# Altium schematic sheet schematic.SchDoc
size A2
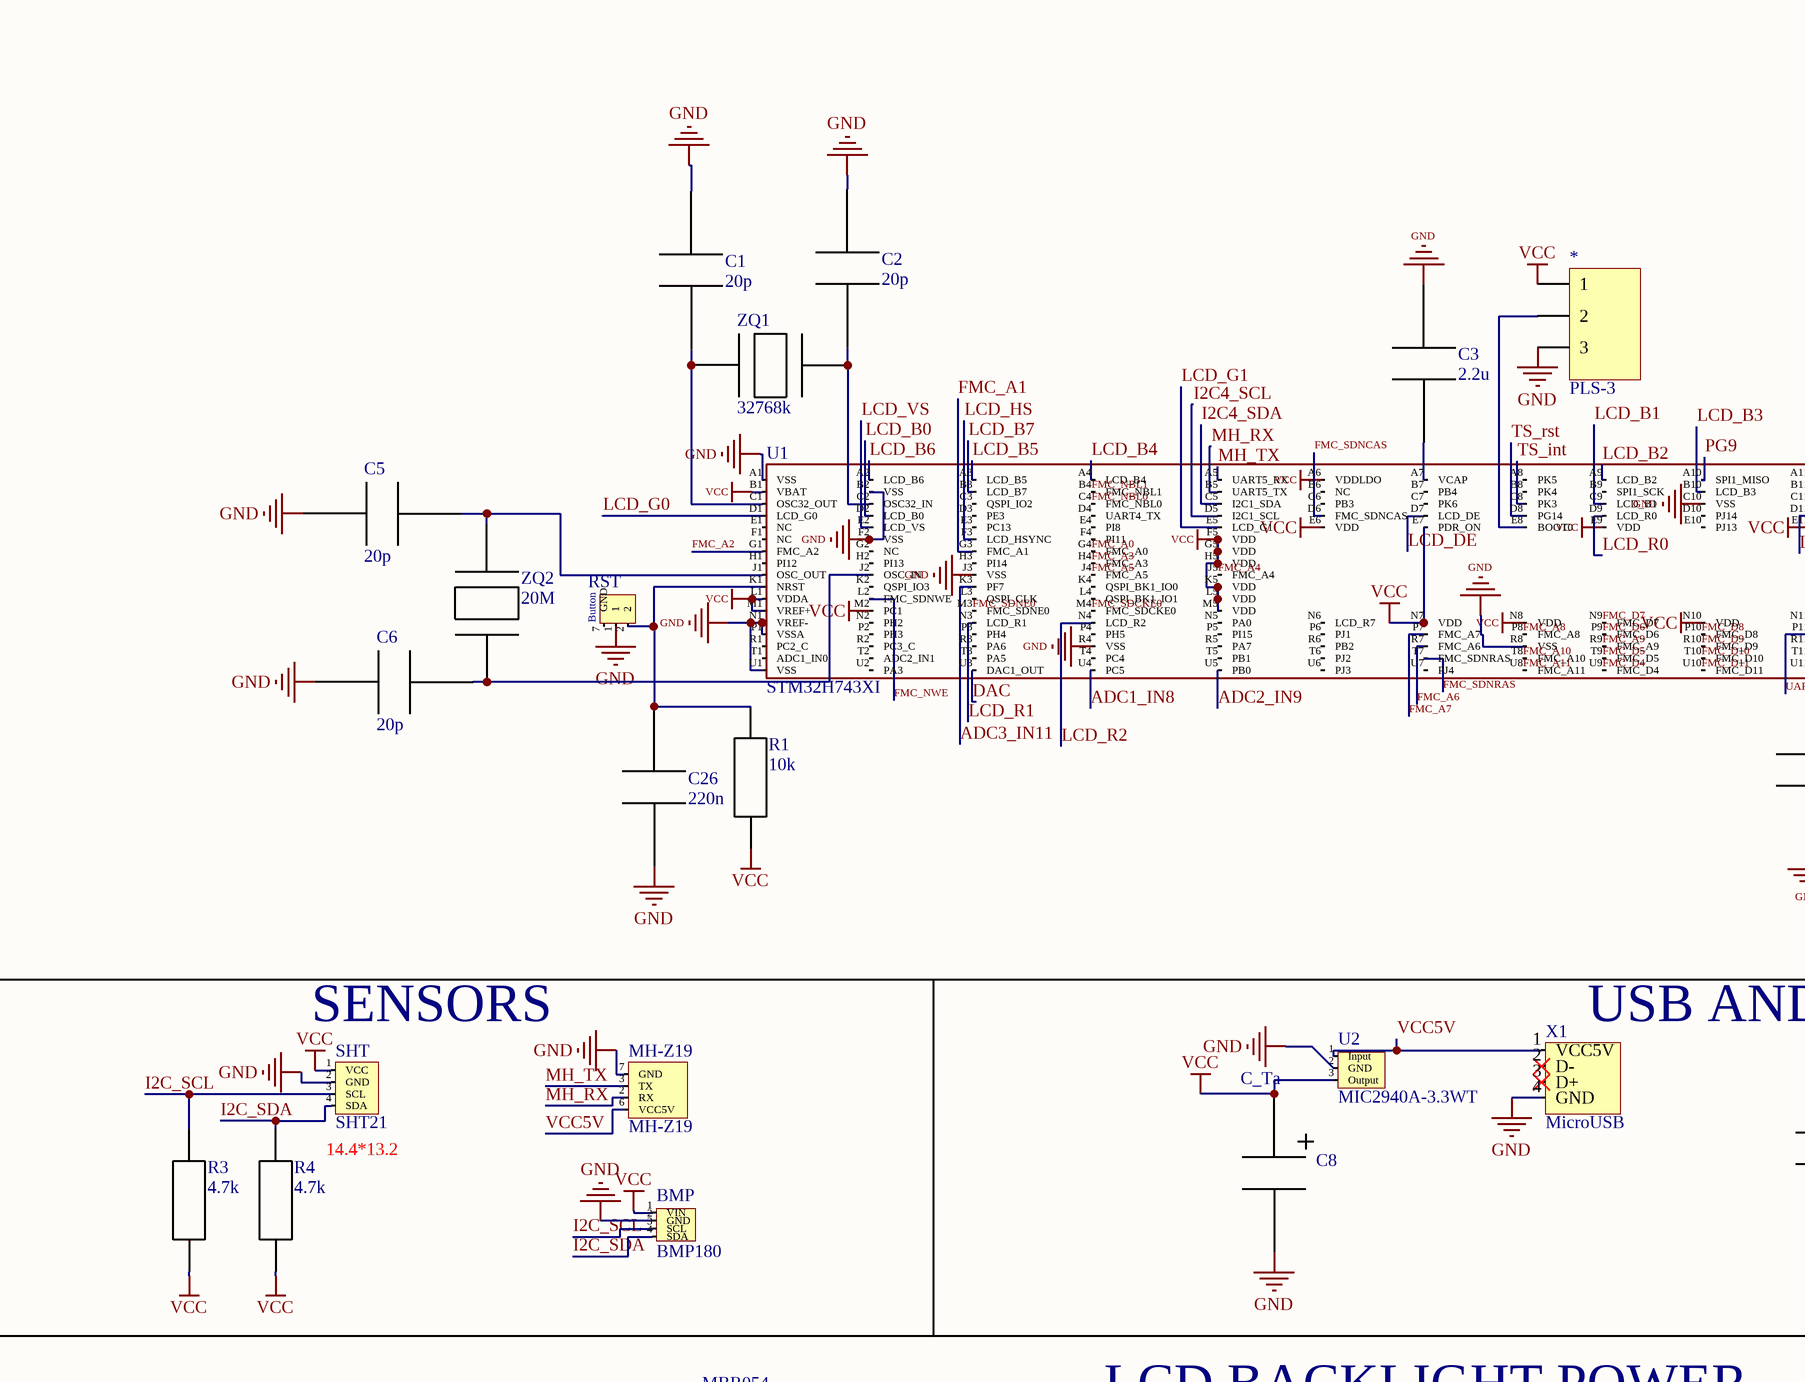
[diagram p0: schematic.SchDoc, top left]
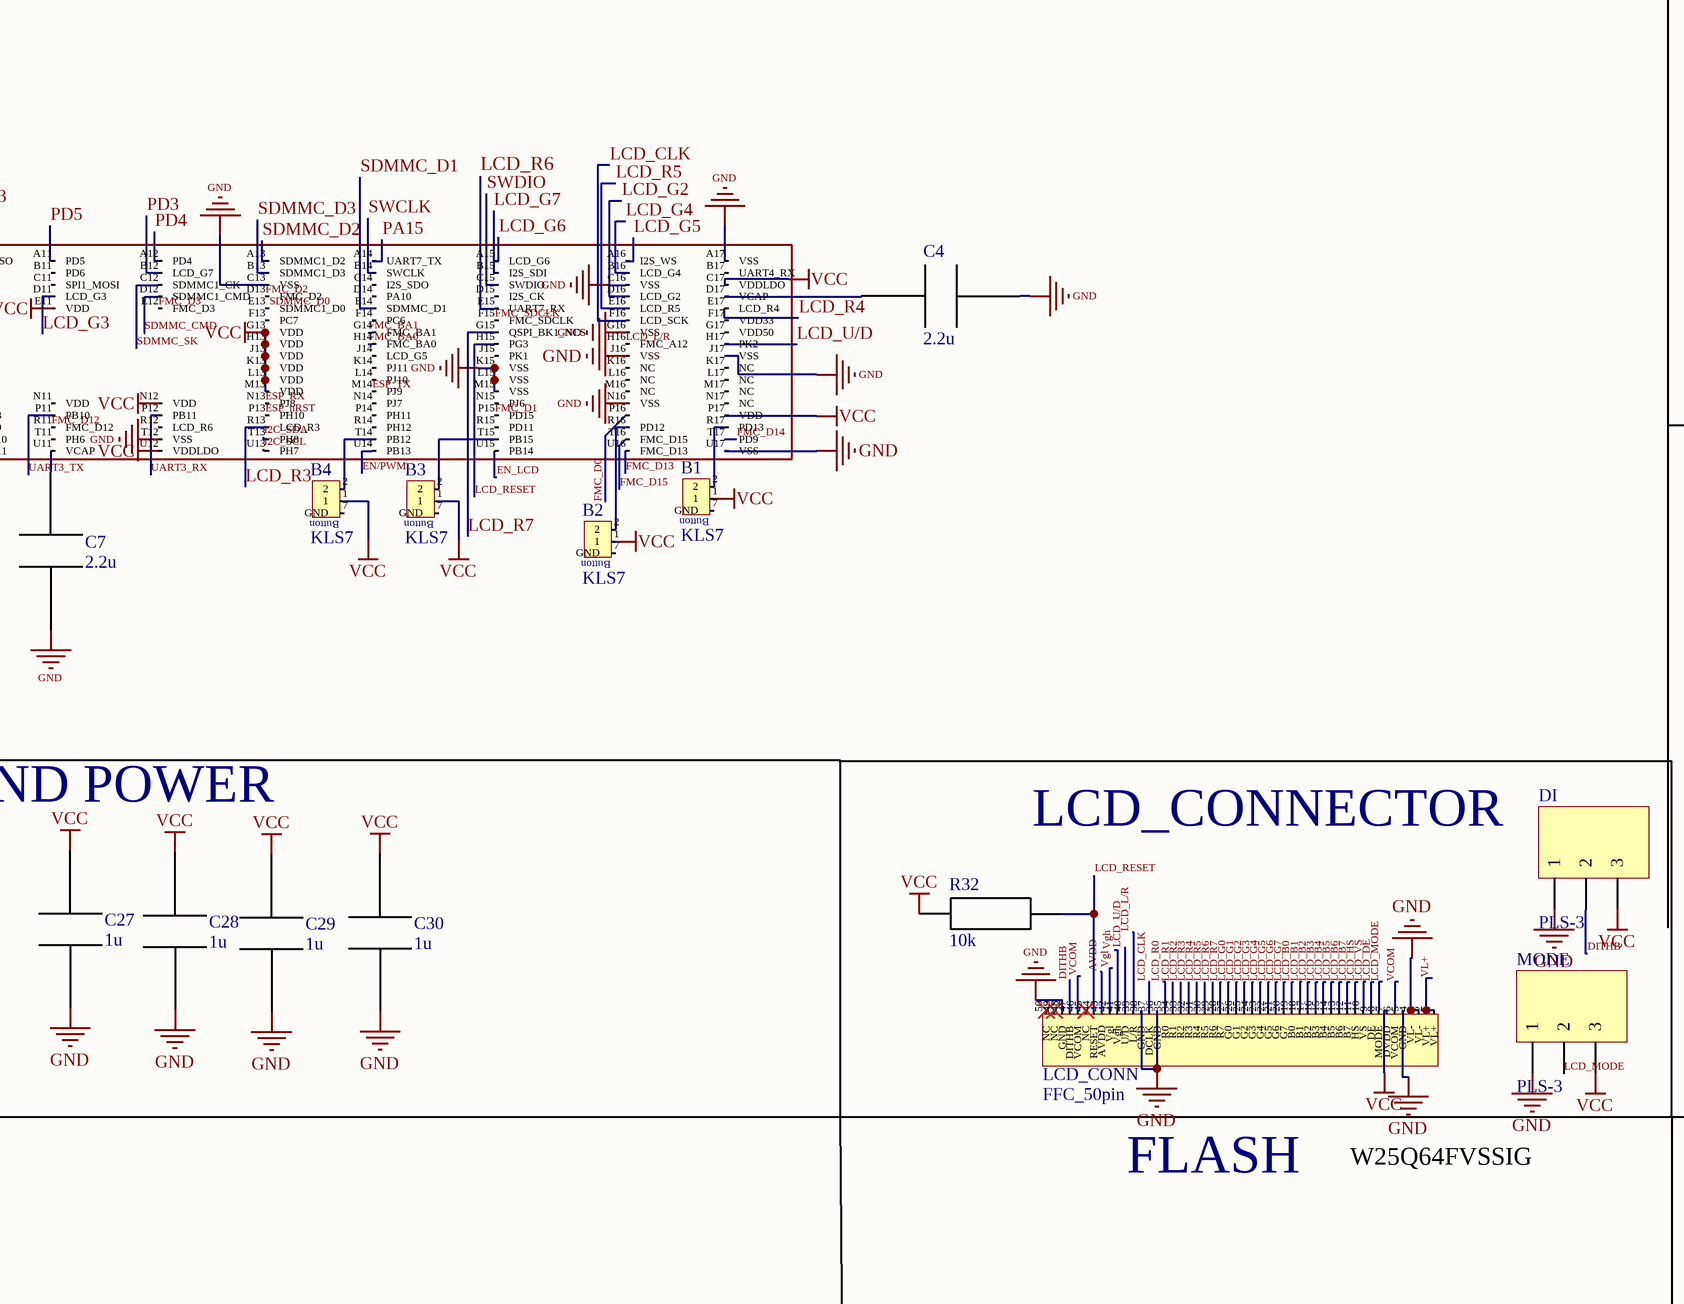
[diagram p1: schematic.SchDoc, top middle]
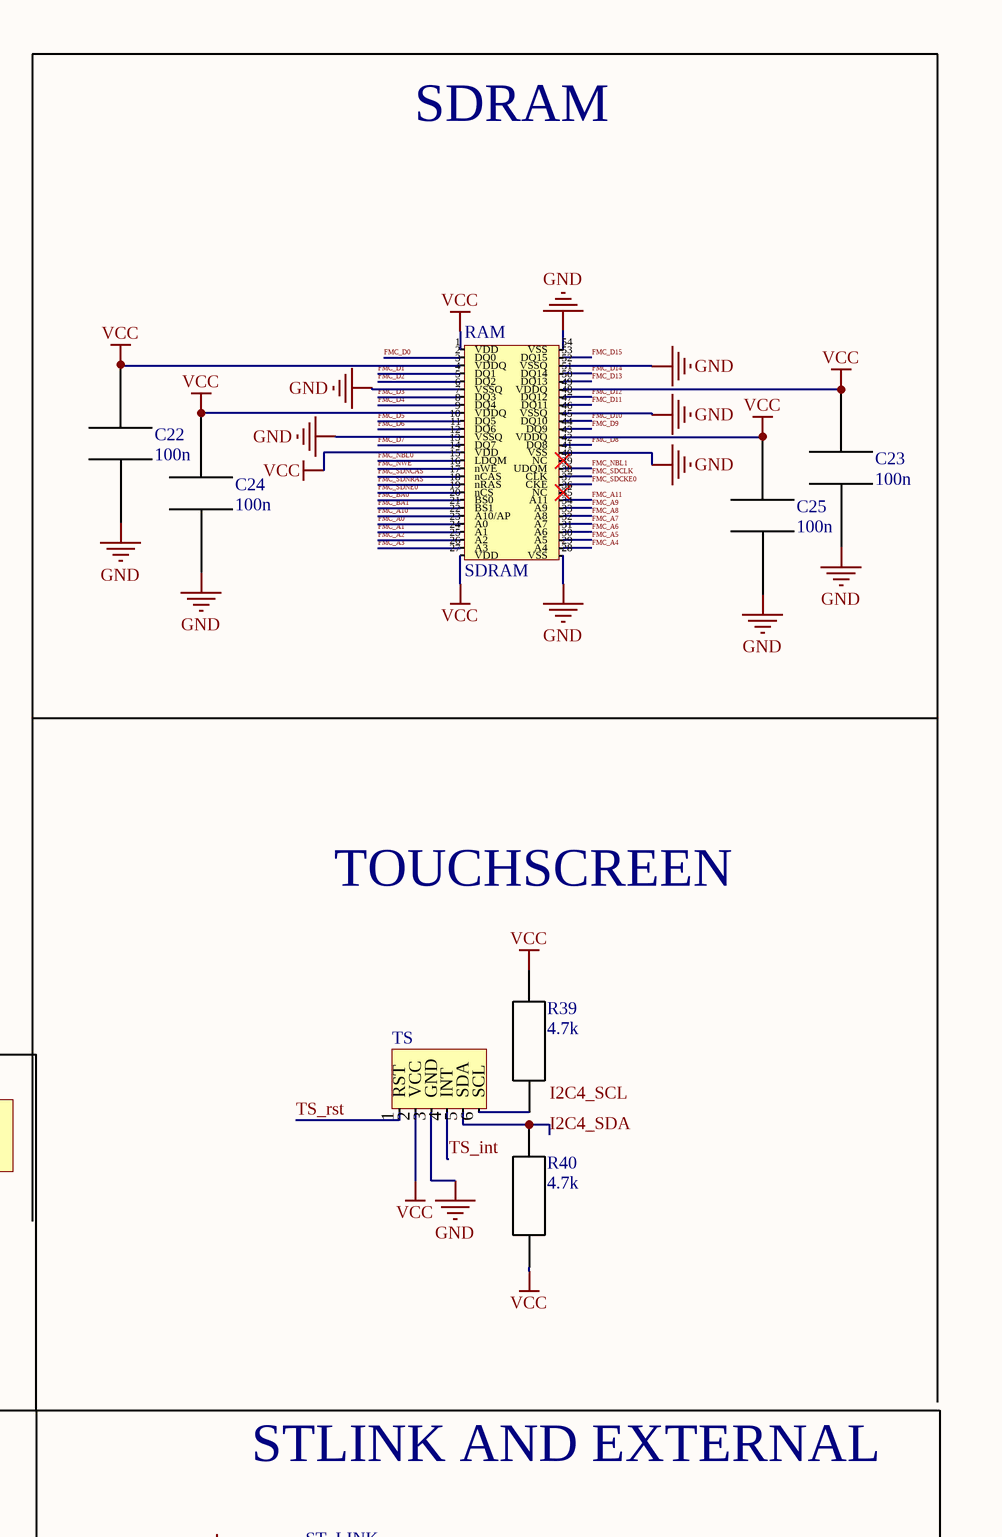
[diagram p2: schematic.SchDoc, top right]
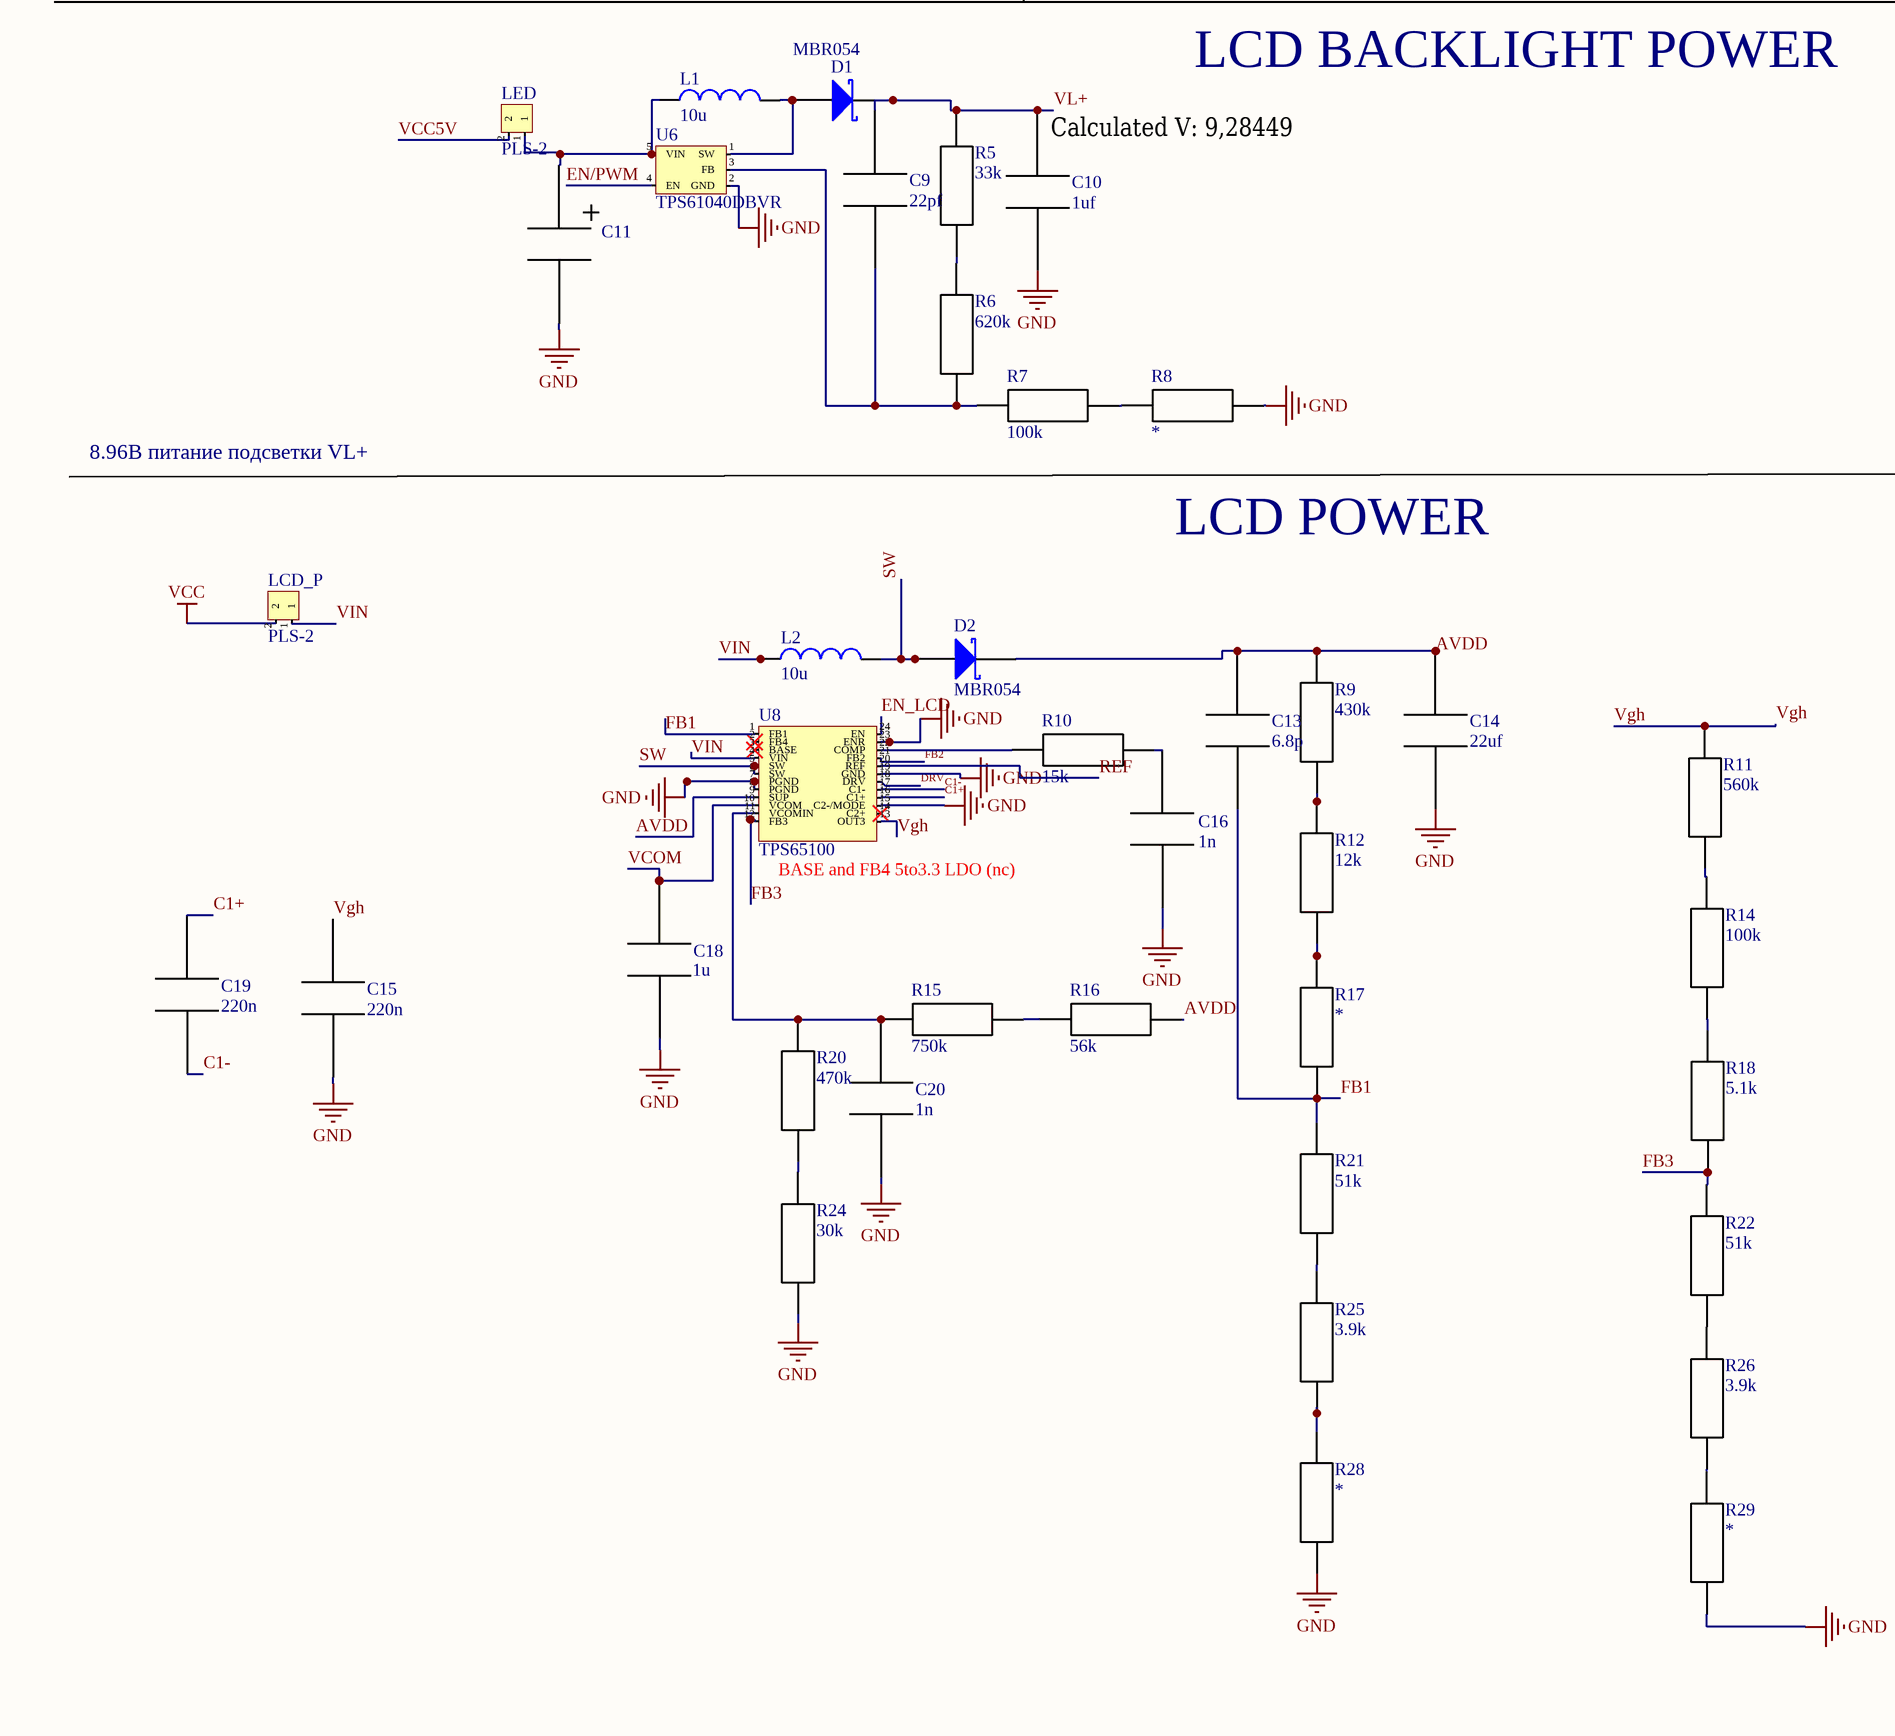
[diagram p3: schematic.SchDoc, bottom left]
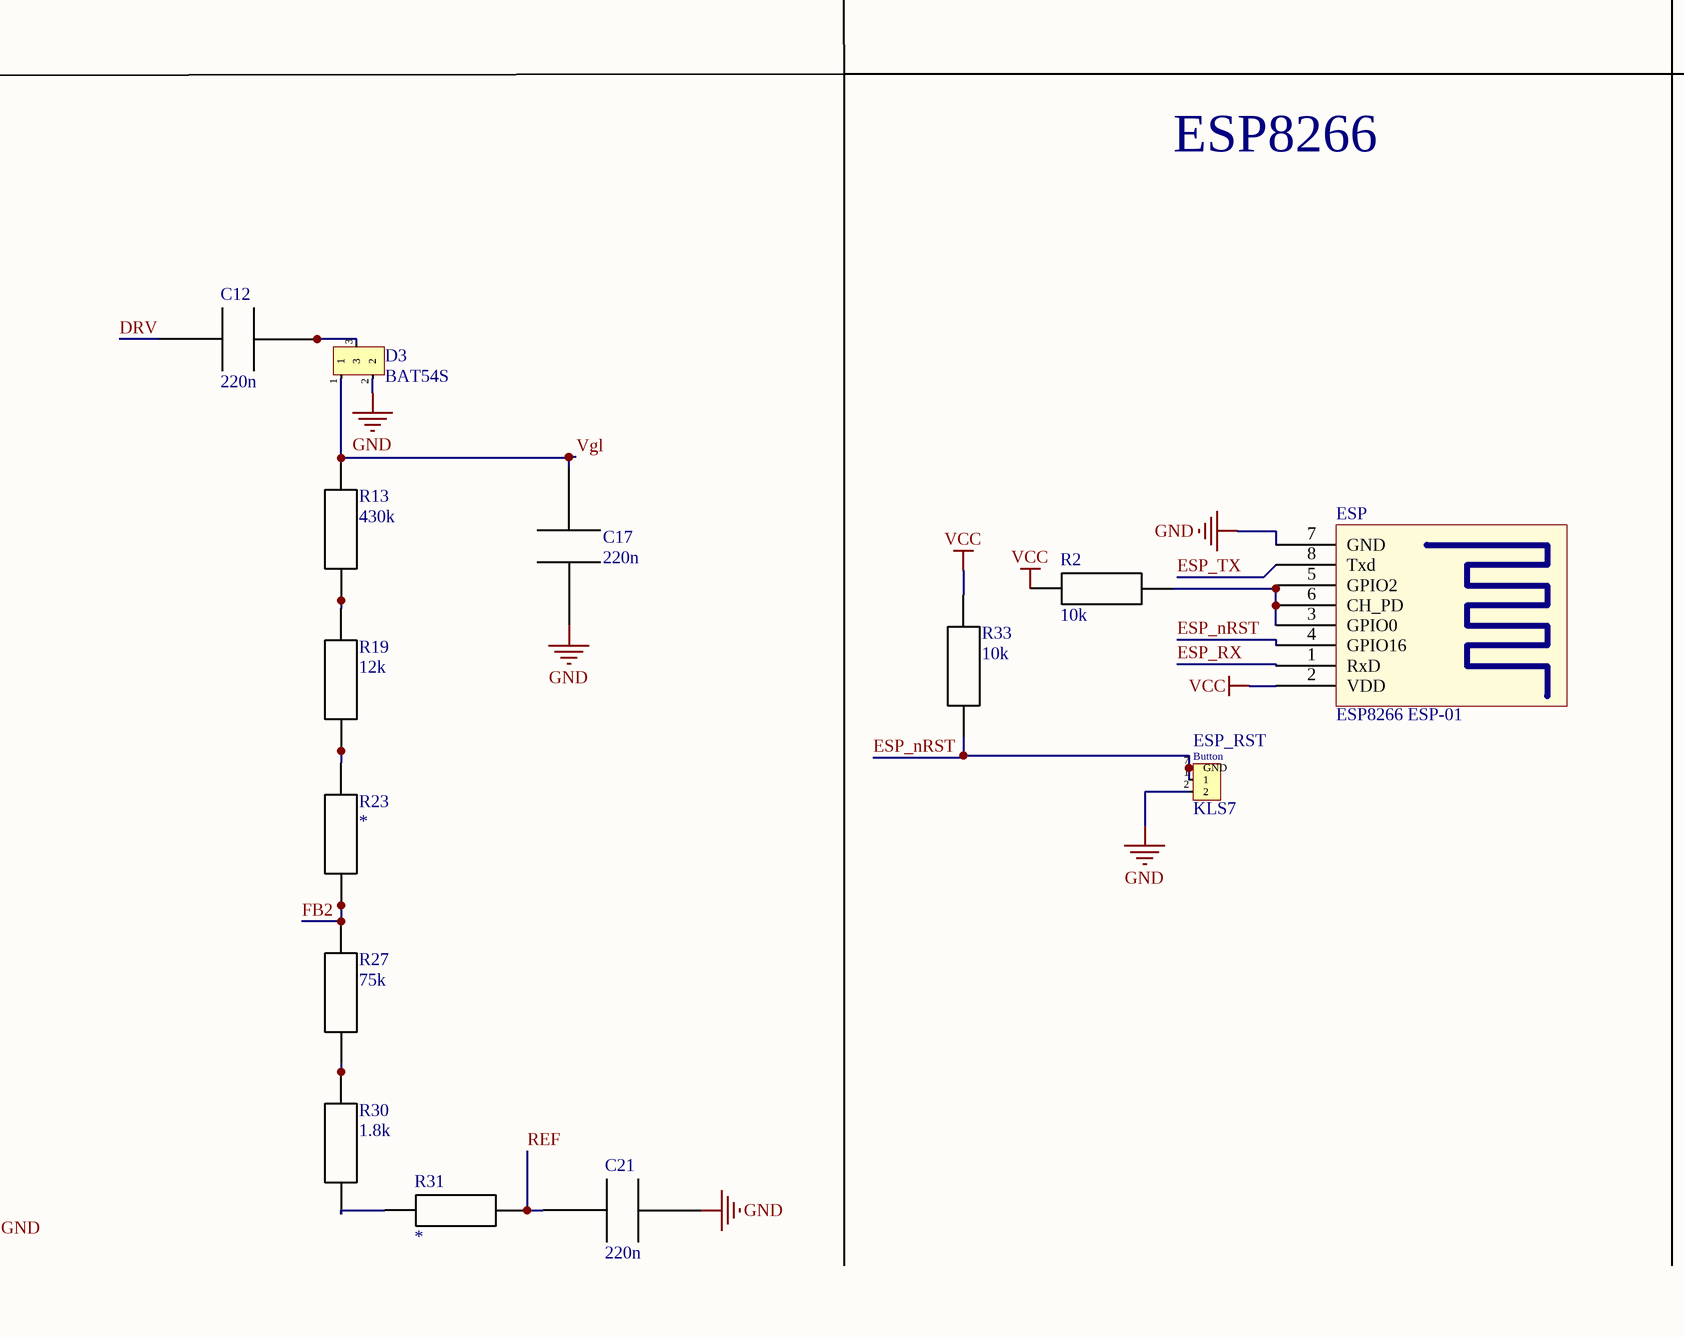
[diagram p4: schematic.SchDoc, bottom middle]
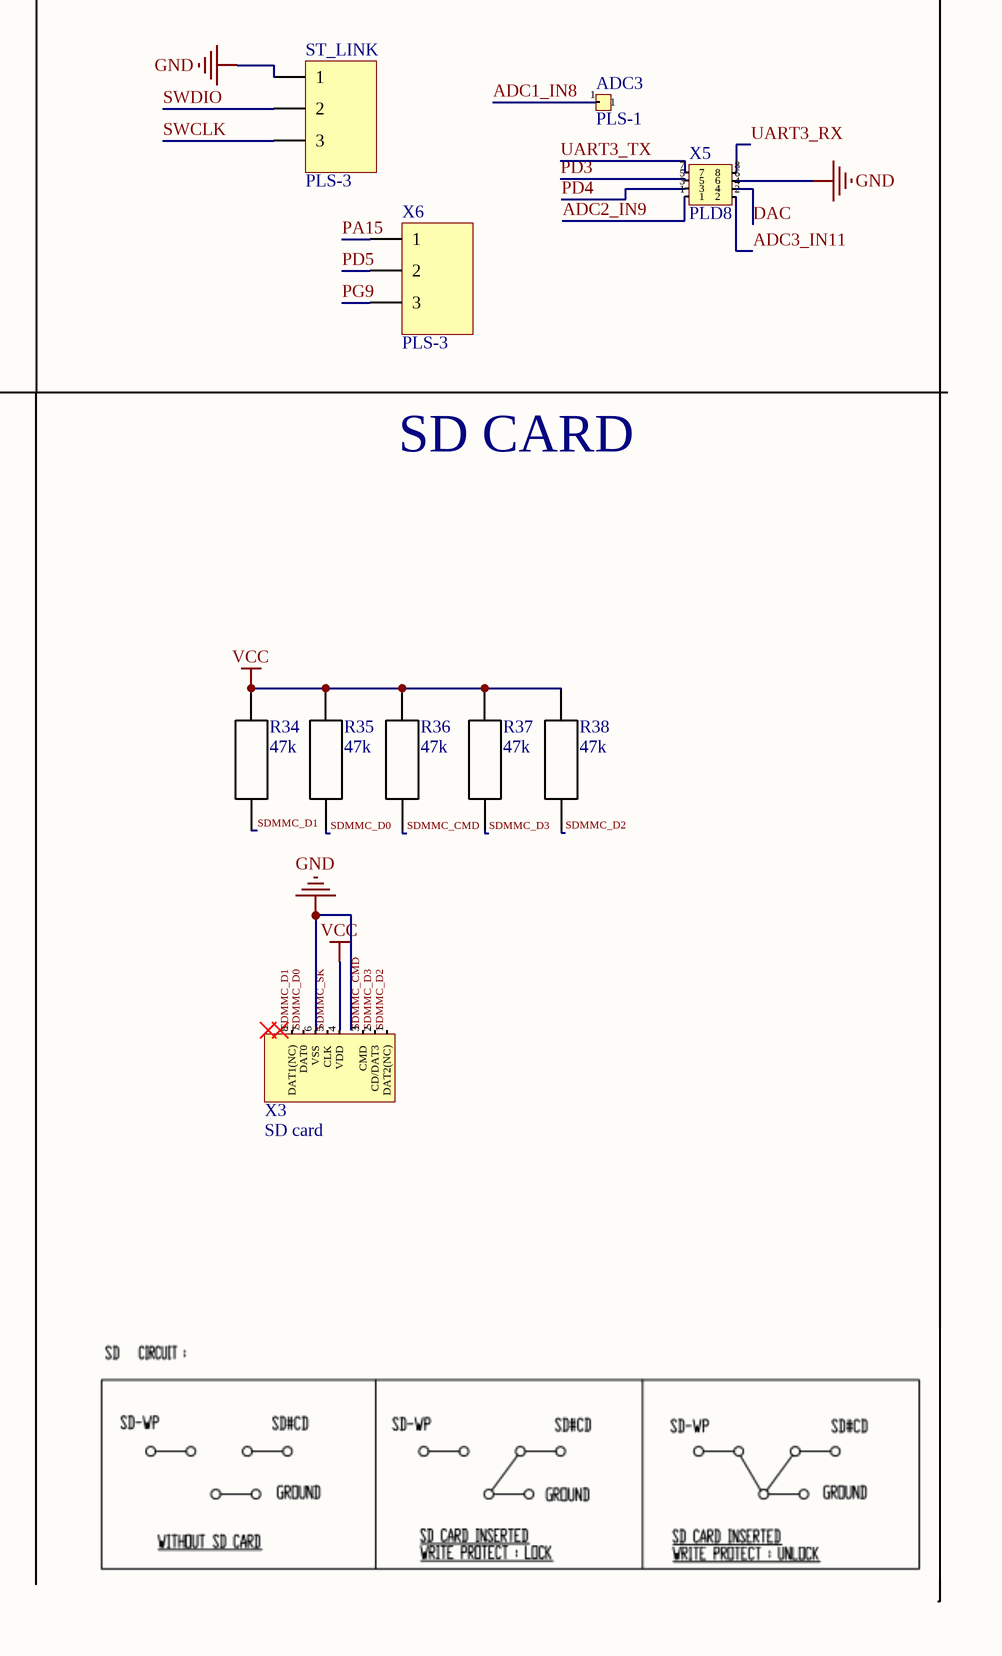
[diagram p5: schematic.SchDoc, bottom right]

## Parts
*  PLS-3  [PLS-3]
ADC3  PLS-1  [pls-1]
B1  KLS7  [angle_button]
B2  KLS7  [angle_button]
B3  KLS7  [angle_button]
B4  KLS7  [angle_button]
BMP  BMP180  [PLS-4]
C1  20p  [0805]
C2  20p  [0805]
C3  2.2u  [0805]
C4  2.2u  [0805]
C5  20p  [0805]
C6  20p  [0805]
C7  2.2u  [0805]
C8  C_Ta  [C_Ta]
C9  22pf  [0805]
C10  1uf  [0805]
C11  C_Ta  [C_Ta]  (value not drawn)
C12  220n  [0805]
C13  6.8p  [0805]
C14  22uf  [0805]
C15  220n  [0805]
C16  1n  [0805]
C17  220n  [0805]
C18  1u  [0805]
C19  220n  [0805]
C20  1n  [0805]
C21  220n  [0805]
C22  100n  [0805]
C23  100n  [0805]
C24  100n  [0805]
C25  100n  [0805]
C26  220n  [0805]
C27  1u  [0603]
C28  1u  [0603]
C29  1u  [0603]
C30  1u  [0603]
D1  MBR054  [sod123]
D2  MBR054  [sod123]
D3  BAT54S  [sot23]
DI  PLS-3  [PLS-3]
ESP  ESP8266 ESP-01  [ESP8266 ESP-01]
ESP_RST  KLS7  [KLS7]
L1  10u  [0604]
L2  10u  [0604]
LCD_CONN  FFC_50pin  [FFC_50pin]
LCD_P  PLS-2  [PLS-2]
LED  PLS-2  [PLS-2]
MH-Z19  MH-Z19  [MH-Z19]
MODE  PLS-3  [PLS-3]
R1  10k  [0805]
R2  10k  [0805]
R3  4.7k  [0805]
R4  4.7k  [0805]
R5  33k  [0805]
R6  620k  [0805]
R7  100k  [0805]
R8  *  [0805]
R9  430k  [0805]
R10  15k  [0805]
R11  560k  [0805]
R12  12k  [0805]
R13  430k  [0805]
R14  100k  [0805]
R15  750k  [0805]
R16  56k  [0805]
R17  *  [0805]
R18  5.1k  [0805]
R19  12k  [0805]
R20  470k  [0805]
R21  51k  [0805]
R22  51k  [0805]
R23  *  [0805]
R24  30k  [0805]
R25  3.9k  [0805]
R26  3.9k  [0805]
R27  75k  [0805]
R28  *  [0805]
R29  *  [0805]
R30  1.8k  [0805]
R31  *  [0805]
R32  10k  [0805]
R33  10k  [0805]
R34  47k  [0805]
R35  47k  [0805]
R36  47k  [0805]
R37  47k  [0805]
R38  47k  [0805]
R39  4.7k  [0805]
R40  4.7k  [0805]
RAM  SDRAM  [SDRAM TSOP2]
RST  KLS7  [KLS7]  (value not drawn)
SHT  SHT21  [PLS-4]
ST_LINK  PLS-3  [PLS-3]
TS  FFC_6pin  (value not drawn)
U1  STM32H743XI  [STM32H742xI]
U2  MIC2940A-3.3WT  [PLS-3]
U6  TPS61040DBVR  [sot-23-5]
U8  TPS65100  [TPS6510]
X1  MicroUSB  [MICRO_USB]
X3  SD card  [microSDconn]
X5  PLD8  [PLD-8]
X6  PLS-3  [PLS-3]
ZQ1  32768k  [XTAL]
ZQ2  20M  [XTAL]

## Nets
LCD_G2: *.3 BMP.2(GND) C1.1 C2.1 C3.2 C4.2 C5.1 C6.1 C7.2 C8.2 C10.1 C11.2 C14.1 C15.2 C16.2 C17.2 C18.2 C20.2 C21.2 C22.2 C23.2 C24.2 C25.2 C26.2 C27.1 C28.1 C29.1 C30.1 D3.2 DI.1 ESP.7(GND) ESP_RST.2 LCD_CONN.3(VL-) LCD_CONN.4(VL-) LCD_CONN.5(GND) LCD_CONN.25(G2) LCD_CONN.36(GND) LCD_CONN.38(GND) LCD_CONN.48(GND) MH-Z19.7(GND) MODE.1 R8.1 R24.2 R28.1 R29.1 RAM.6(VSSQ) RAM.12(VSSQ) RAM.28(VSS) RAM.41(VSS) RAM.46(VSSQ) RAM.52(VSSQ) RAM.54(VSS) RST.1 SHT.2(GND) ST_LINK.1 TS.3(GND) U1.A1(VSS) U1.A17(VSS) U1.B2(VSS) U1.C10(VSS) U1.C13(VSS) U1.C16(VSS) U1.D16(LCD_G2) U1.F2(VSS) U1.G16(VSS) U1.J3(VSS) U1.J16(VSS) U1.J17(VSS) U1.K15(VSS) U1.L15(VSS) U1.M15(VSS) U1.N1(VREF-) U1.N16(VSS) U1.P1(VSSA) U1.R4(VSS) U1.R8(VSS) U1.T12(VSS) U1.U1(VSS) U1.U17(VSS) U2.2(GND) U6.2(GND) U8.7(PGND) U8.8(PGND) U8.15(C2-/MODE) U8.19(GND) U8.23(ENR) X1.4(GND) X3.6(VSS) X5.6  [also labelled GND]
VCC: *.1 B1.1 B2.1 B3.1 B4.1 BMP.1(VIN) C8.1 C22.1 C23.1 C24.1 C25.1 C27.2 C28.2 C29.2 C30.2 DI.3 ESP.2(VDD) LCD_CONN.7(DVDD) LCD_P.2 MODE.3 R1.1 R2.1 R3.2 R4.2 R32.1 R33.2 R34.2 R35.2 R36.2 R37.2 R38.2 R39.2 R40.1 RAM.1(VDD) RAM.3(VDDQ) RAM.9(VDDQ) RAM.14(VDD) RAM.27(VDD) RAM.43(VDDQ) RAM.49(VDDQ) SHT.1(VCC) TS.2(VCC) U1.A6(VDDLDO) U1.B1(VBAT) U1.C17(VDDLDO) U1.E6(VDD) U1.E7(PDR_ON) U1.E9(VDD) U1.E11(VDD) U1.F5(VDD) U1.G5(VDD) U1.G13(VDD) U1.H5(VDD) U1.H13(VDD) U1.J13(VDD) U1.K5(VDD) U1.K13(VDD) U1.L1(VDDA) U1.L5(VDD) U1.L13(VDD) U1.M1(VREF+) U1.M2(PC1) U1.M5(VDD) U1.M13(VDD) U1.N7(VDD) U1.N8(VDD) U1.N10(VDD) U1.N12(VDD) U1.P17(VDD) U1.U12(VDDLDO) U2.3(Output) X3.4(VDD)
ADC1_IN8: ADC3.1 U1.U4(PC5)
ADC2_IN9: U1.U5(PB0) X5.1
ADC3_IN11: U1.K3(PF7) X5.2
AVDD: C13.2 C14.2 D2.2(K) LCD_CONN.43(AVDD) R9.1 R16.2 U8.9(SUP)
C1+: C19.1 U8.16(C1+)
C1-: C19.2 U8.17(C1-)
DAC: U1.U3(DAC1_OUT) X5.4
DITHB: DI.2 LCD_CONN.47(DITHB)
DRV: C12.1 U8.18(DRV)
EN/PWM: U1.U14(PB13) U6.4(EN)
EN_LCD: U1.U15(PB14) U8.24(EN)
ESP_nRST: ESP.4(GPIO16) ESP_RST.1 ESP_RST.7(GND) R33.1 U1.P13(PH10)
ESP_RX: ESP.1(RxD) U1.N13(PJ8)
ESP_TX: ESP.8(Txd) U1.M14(PJ9)
FB1: C13.1 R17.1 R21.2 U8.1(FB1)
FB2: R23.1 R27.1 U8.21(FB2)
FB3: R18.1 R22.1 U8.12(FB3)
FMC_A0: RAM.23(A0) U1.G4(FMC_A0)
FMC_A1: RAM.24(A1) U1.G3(FMC_A1)
FMC_A2: RAM.25(A2) U1.G1(FMC_A2)
FMC_A3: RAM.26(A3) U1.H4(FMC_A3)
FMC_A4: RAM.29(A4) U1.J5(FMC_A4)
FMC_A5: RAM.30(A5) U1.J4(FMC_A5)
FMC_A6: RAM.31(A6) U1.R7(FMC_A6)
FMC_A7: RAM.32(A7) U1.P7(FMC_A7)
FMC_A8: RAM.33(A8) U1.P8(FMC_A8)
FMC_A9: RAM.34(A9) U1.R9(FMC_A9)
FMC_A10: RAM.22(A10/AP) U1.T8(FMC_A10)
FMC_A11: RAM.35(A11) U1.U8(FMC_A11)
FMC_BA0: RAM.20(BS0) U1.H14(FMC_BA0)
FMC_BA1: RAM.21(BS1) U1.G14(FMC_BA1)
FMC_D0: RAM.2(DQ0) U1.P16
FMC_D1: RAM.4(DQ1) U1.P15(PD15)
FMC_D2: RAM.5(DQ2) U1.D13(FMC_D2)
FMC_D3: RAM.7(DQ3) U1.E12(FMC_D3)
FMC_D4: RAM.8(DQ4) U1.U9(FMC_D4)
FMC_D5: RAM.10(DQ5) U1.T9(FMC_D5)
FMC_D6: RAM.11(DQ6) U1.P9(FMC_D6)
FMC_D7: RAM.13(DQ7) U1.N9(FMC_D7)
FMC_D8: RAM.42(DQ8) U1.P10(FMC_D8)
FMC_D9: RAM.44(DQ9) U1.R10(FMC_D9)
FMC_D10: RAM.45(DQ10) U1.T10(FMC_D10)
FMC_D11: RAM.47(DQ11) U1.U10(FMC_D11)
FMC_D12: RAM.48(DQ12) U1.R11(FMC_D12)
FMC_D13: RAM.50(DQ13) U1.U16(FMC_D13)
FMC_D14: RAM.51(DQ14) U1.T17(PD9)
FMC_D15: RAM.53(DQ15) U1.T16(FMC_D15)
FMC_NBL0: RAM.15(LDQM) U1.C4(FMC_NBL0)
FMC_NBL1: RAM.39(UDQM) U1.B4(FMC_NBL1)
FMC_NWE: RAM.16(nWE) U1.L2(FMC_SDNWE)
FMC_SDCKE0: RAM.37(CKE) U1.M4(FMC_SDCKE0)
FMC_SDCLK: RAM.38(CLK) U1.F15(FMC_SDCLK)
FMC_SDNCAS: RAM.17(nCAS) U1.D6(FMC_SDNCAS)
FMC_SDNE0: RAM.19(nCS) U1.M3(FMC_SDNE0)
FMC_SDNRAS: RAM.18(nRAS) U1.T7(FMC_SDNRAS)
I2C4_SCL: U1.D5(I2C1_SCL)
I2C4_SDA: R40.2 TS.5(SDA) U1.C5(I2C1_SDA)
I2C_SCL: BMP.3(SCL) R3.1 SHT.3(SCL) U1.U13(PH7)
I2C_SDA: BMP.4(SDA) R4.1 SHT.4(SDA) U1.T13(PH8)
LCD_B0: LCD_CONN.19(B0) U1.D2(LCD_B0)
LCD_B1: LCD_CONN.18(B1) U1.C9(LCD_B1)
LCD_B2: LCD_CONN.17(B2) U1.A9(LCD_B2)
LCD_B3: LCD_CONN.16(B3) U1.B10(LCD_B3)
LCD_B4: LCD_CONN.15(B4) U1.A4(LCD_B4)
LCD_B5: LCD_CONN.14(B5) U1.A3(LCD_B5)
LCD_B6: LCD_CONN.13(B6) U1.A2(LCD_B6)
LCD_B7: LCD_CONN.12(B7) U1.B3(LCD_B7)
LCD_CLK: LCD_CONN.37(DCLK) U1.F16(LCD_SCK)
LCD_DE: LCD_CONN.9(DE) U1.D7(LCD_DE)
LCD_G0: LCD_CONN.27(G0) U1.D1(LCD_G0)
LCD_G1: LCD_CONN.26(G1) U1.E5(LCD_G1)
LCD_G3: LCD_CONN.24(G3) U1.D11(LCD_G3)
LCD_G4: LCD_CONN.23(G4) U1.B16(LCD_G4)
LCD_G5: LCD_CONN.22(G5) U1.A16(I2S_WS)
LCD_G6: LCD_CONN.21(G6) U1.A15(LCD_G6)
LCD_G7: LCD_CONN.20(G7) U1.B15(I2S_SDI)
LCD_HS: LCD_CONN.11(HS) U1.F3(LCD_HSYNC)
LCD_L/R: LCD_CONN.39(L/R) U1.H16(FMC_A12)
LCD_MODE: LCD_CONN.8(MODE) MODE.2
LCD_R0: LCD_CONN.35(R0) U1.D9(LCD_R0)
LCD_R1: LCD_CONN.34(R1) U1.N3(LCD_R1)
LCD_R2: LCD_CONN.33(R2) U1.N4(LCD_R2)
LCD_R3: LCD_CONN.32(R3) U1.R13(LCD_R3)
LCD_R4: LCD_CONN.31(R4) U1.E17(LCD_R4)
LCD_R5: LCD_CONN.30(R5) U1.E16(LCD_R5)
LCD_R6: LCD_CONN.29(R6) U1.E15(UART7_RX)
LCD_R7: LCD_CONN.28(R7) U1.G15(QSPI_BK1_NCS)
LCD_RESET: LCD_CONN.44(RESET) R32.2 U1.H15(PG3)
LCD_U/D: LCD_CONN.40(U/D) U1.H17(PK2)
LCD_VS: LCD_CONN.10(VS) U1.E2(LCD_VS)
MH_RX: MH-Z19.2(RX) U1.B5(UART5_TX)
MH_TX: MH-Z19.3(TX) U1.A5(UART5_RX)
PA15: U1.A14(UART7_TX) X6.1
PD3: U1.B12(LCD_G7) X5.5
PD4: U1.A12(PD4) X5.3
PD5: U1.A11(PD5) X6.2
PG9: U1.A10(SPI1_MISO) X6.3
REF: C21.1 R31.1 U8.20(REF)
SDMMC_CMD: R36.1 U1.D12(SDMMC1_CMD) X3.3(CMD)
SDMMC_D0: R35.1 U1.E13(SDMMC1_D0) X3.7(DAT0)
SDMMC_D1: R34.1 U1.E14(SDMMC_D1) X3.8(DAT1(NC))
SDMMC_D2: R38.1 U1.A13(SDMMC1_D2) X3.1(DAT2(NC))
SDMMC_D3: R37.1 U1.B13(SDMMC1_D3) X3.2(CD/DAT3)
SDMMC_SK: U1.C12(SDMMC1_CK) X3.5(CLK)
SW: D2.1(A) L2.2 U8.5(SW) U8.6(SW)
SWCLK: ST_LINK.3 U1.B14(SWCLK)
SWDIO: ST_LINK.2 U1.C15(SWDIO)
TS_int: TS.4(INT) U1.C8(PK3)
TS_rst: TS.1(RST) U1.D8(PG14)
UART3_RX: U1.P12(PB11) X5.8
UART3_TX: U1.P11(PB10) X5.7
VCC5V: LED.2 MH-Z19.6(VCC5V) U2.1(Input) X1.1(VCC5V)
VCOM: C18.1 LCD_CONN.6(VCOM) LCD_CONN.46(VCOM) U8.10(VCOM)
Vgh: C15.1 LCD_CONN.41(Vgh) R11.1 U8.13(OUT3)
Vgl: C17.1 D3.1 LCD_CONN.42(Vgl) R13.1
VIN: L2.1 LCD_P.1 U8.4(VIN)
VL+: C9.2 C10.2 D1.2(K) LCD_CONN.1(VL+) LCD_CONN.2(VL+) R5.2
Net*_2: *.2 U1.E8(BOOT0)
NetB1_2: B1.2 U1.R17(PD13)
NetB2_2: B2.2 U1.R16(PD12)
NetB3_2: B3.2 U1.T15(PB15)
NetB4_2: B4.2 U1.T14(PB12)
NetC1_2: C1.2 U1.C1(OSC32_OUT) ZQ1.1
NetC2_2: C2.2 U1.C2(OSC32_IN) ZQ1.2
NetC3_1: C3.1 U1.A7(VCAP)
NetC4_1: C4.1 U1.D17(VCAP)
NetC5_2: C5.2 U1.J1(OSC_OUT) ZQ2.2
NetC6_2: C6.2 U1.J2(OSC_IN) ZQ2.1
NetC7_1: C7.1 U1.U11(VCAP)
NetC9_1: C9.1 R6.1 R7.2 U6.3(FB)
NetC11_1: C11.1 L1.1 LED.1 U6.5(VIN)
NetC12_2: C12.2 D3.3
NetC16_1: C16.1 R10.2
NetC20_1: C20.1 R15.1 R20.2 U8.11(VCOMIN)
NetC26_1: C26.1 R1.2 RST.2 U1.K1(NRST)
NetD1_1: D1.1(A) L1.2 U6.1(SW)
NetESP_3: ESP.3(GPIO0) ESP.5(GPIO2) ESP.6(CH_PD) R2.2
NetR5_1: R5.1 R6.2
NetR7_1: R7.1 R8.2
NetR9_2: R9.2 R12.2
NetR10_1: R10.1 U8.22(COMP)
NetR11_2: R11.2 R14.1
NetR12_1: R12.1 R17.2
NetR13_2: R13.2 R19.2
NetR14_2: R14.2 R18.2
NetR15_2: R15.2 R16.1
NetR19_1: R19.1 R23.2
NetR20_1: R20.1 R24.1
NetR21_1: R21.1 R25.2
NetR22_2: R22.2 R26.1
NetR25_1: R25.1 R28.2
NetR26_2: R26.2 R29.2
NetR27_2: R27.2 R30.2
NetR30_1: R30.1 R31.2
NetR39_1: R39.1 TS.6(SCL)

Not connected (* = marked no-connect by the designer): B1 7(GND); B2 7(GND); B3 7(GND); B4 7(GND); LCD_CONN 45(NC)* 49(NC)* 50(NC)*; RAM 36(NC)* 40(NC)*; RST 7(GND); U1 A8(PK5) B6(NC) B7(PB4) B8(PK4) B9(SPI1_SCK) B11(PD6) B17(UART4_RX) C3(QSPI_IO2) C6(PB3) C7(PK6) C11(SPI1_MOSI) C14(I2S_SDO) D3(PE3) D4(UART4_TX) D10(PJ14) D14(PA10) D15(I2S_CK) E1(NC) E3(PC13) E4(PI8) E10(PJ13) F1(NC) F4(PI11) F13(PC7) F14(PC6) F17(VDD33) G2(NC) G17(VDD50) H1(PI12) H2(PI13) H3(PI14) J14(LCD_G5) J15(PK1) K2(QSPI_IO3) K4(QSPI_BK1_IO0) K14(PJ11) K16(NC) K17(NC) L3(QSPI_CLK) L4(QSPI_BK1_IO1) L14(PJ10) L16(NC) L17(NC) M16(NC) M17(NC) N2(PH2) N5(PA0) N6(LCD_R7) N11(VDD) N14(PJ7) N15(PJ6) N17(NC) P2(PH3) P3(PH4) P4(PH5) P5(PI15) P6(PJ1) P14(PH11) R1(PC2_C) R2(PC3_C) R3(PA6) R5(PA7) R6(PB2) R12(LCD_R6) R14(PH12) R15(PD11) T1(ADC1_IN0) T2(ADC2_IN1) T3(PA5) T4(PC4) T5(PB1) T6(PJ2) T11(PH6) U2(PA3) U6(PJ3) U7(PJ4); U8 2(FB4)* 3(BASE)* 14(C2+)*; X1 2(D-)* 3(D+)*

## Notes on the sheet
- SDRAM
- TOUCHSCREEN
- (near SHT) SENSORS
- (near X1) USB AND POWER
- (near R32) LCD_CONNECTOR
- 14.4*13.2
- LCD BACKLIGHT POWER
- FLASH
- W25Q64FVSSIG
- STLINK AND EXTERNAL
- (near C10) Calculated V: 9,28449‬
- 8.96В питание подсветки VL+
- LCD POWER
- ESP8266
- SD CARD
- (near U8) BASE and FB4 5to3.3 LDO (nc)
- Labels drawn without touching a wire or pin: I2C4_SCL
- Title
- Size:
- Date:
- File:
- A2
- Number:
- Time:
- Revision:
- Sheet
- of
- (in symbol KLS7) Button

## Library data of the parts
BMP = BMP180: Pressure sensor
C1-C7 C9 C10 C12 C13 C15-C30 = C0805: 0805 ceramic capacitor; Capacity: *
C8 C11 = C_Ta: tantalum capacitor
C14 = C0805: 0805 ceramic capacitor 25V; Capacity: *
D1 = D Schottky: Schottky Diode; Published: 8-Jun-2000; LatestRevisionDate: 17-Jul-2002; LatestRevisionNote: Re-released for DXP Platform.; PackageReference: SMB; Publisher: Altium Limited; PackageDescription: DO-214-AA/SMB; 2 C-Bend Leads; Body 5.3 x 3.6 mm, inc. leads (LxW); Code_JEDEC: DO-214-AA
D2 = Diode 11DQ03: Schottky Rectifier; Published: 8-Jun-2000; LatestRevisionDate: 17-Jul-2002; LatestRevisionNote: Re-released for DXP Platform.; DatasheetVersion: Dec-1997; PackageReference: DO-204AL; Publisher: Altium Limited; PackageDescription: Diode, Axial; Body 5.2 x 2.7 mm (LxDia. max), Lead Dia. 0.86 mm (max); Code_JEDEC: DO-204-AL; ComponentLink1Description: Manufacturer Link; ComponentLink1URL: http://www.irf.com/; ComponentLink2Description: Datasheet; ComponentLink2URL: http://www.irf.com/product-info/datasheets/data/11dq03.pdf
L1 L2 = Inductor: Code_IEC: 1005; Value: 10mH; Published: 8-Jun-2000; LatestRevisionDate: 29-May-2009; LatestRevisionNote: IPC-7351 Footprint Added.; PackageReference: 0402-A; Publisher: Altium Limited; PackageDescription: Chip Inductor; Code_JEITA: 0402
R1-R5 R7 R9-R16 R18-R22 R24-R27 R30 R32-R40 = R0805: 0805 resistor; Resistance: *
R6 R8 R17 R23 R28 R29 R31 = R0805: 0805 resistor (reserved); Resistance: *
RAM = SDRAM: W9812G6KH
SHT = SHT21: Temp and hum i2c sensor
U2 = MIC2940A-3.3WT: 1.25A Low Dropout Voltage Regulator
U6 = TPS61040DBVR: LED DRIVER
U8 = TPS65100: LCD POWER DRIVER
X1 = MicroUSB: KLS1-233-0-0-1-T
ZQ1 ZQ2 = XTAL: Frequency: *